# Altium project TS_24_TSAL_PCB.PrjPcb
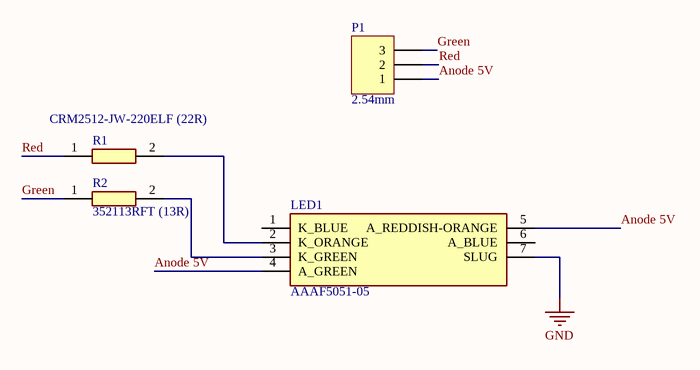
[diagram p0: TSAL_Schematic.SchDoc]
1 sheet, 4 parts. Net scope: global (net labels, ports and power ports of the same name join across sheets).
Board file: PCB1.PcbDoc

## Sheet TSAL_Schematic.SchDoc
size A4

### Parts
LED1  AAAF5051-05  [AAAF505105]
P1  2.54mm  [TH 2.54mm Header 1x3]
R1  CRM2512-JW-220ELF (22R)  [RESC6331X80N]
R2  352113RFT (13R)  [RESC6432X65N]

### Nets
GND: LED1.7(SLUG)
Anode 5V: LED1.4(A_GREEN) LED1.5(A_REDDISH-ORANGE) P1.1
Green: P1.3 R2.1
Red: P1.2 R1.1
NetLED1_2: LED1.2(K_ORANGE) R1.2
NetLED1_3: LED1.3(K_GREEN) R2.2

Not connected (* = marked no-connect by the designer): LED1 1(K_BLUE) 6(A_BLUE)

### Library data of the parts
LED1 = AAAF5051-05: LED; Manufacturer_Name: Kingbright; Datasheet Link: http://www.kingbrightusa.com/images/catalog/SPEC/AAAF5051-05.pdf; Height: 1.4mm; Manufacturer_Part_Number: AAAF5051-05; Mouser Part Number: 604-AAAF5051-05; Mouser Price/Stock: https://www.mouser.co.uk/ProductDetail/Kingbright/AAAF5051-05?qs=wUXugUrL1qwwviBwwIcUtw%3D%3D; Arrow Part Number: AAAF5051-05; Arrow Price/Stock: https://www.arrow.com/en/products/aaaf5051-05/kingbright?region=nac
P1 = TH 2.54mm Header 1x3: Positions: 3; Angle: 0; Flange: No; Contact: NA; Part Number: TH 2.54mm Header 1x3; Pitch: 2.54mm; Row Spacing: 2.54mm
R1 = CRM2512-JW-220ELF: Resistor; Manufacturer_Name: Bourns; Datasheet Link: http://www.bourns.com/data/global/pdfs/CRM0805_1206_2010.pdf; Height: 0.8mm; Manufacturer_Part_Number: CRM2512-JW-220ELF; Mouser Part Number: 652-CRM2512-JW220ELF; Mouser Price/Stock: https://www.mouser.co.uk/ProductDetail/Bourns/CRM2512-JW-220ELF/?qs=9fn1gpisni4fbNEQP%252BkdCw%3D%3D; Arrow Part Number: CRM2512-JW-220ELF; Arrow Price/Stock: https://www.arrow.com/en/products/crm2512-jw-220elf/bourns?region=nac
R2 = 352113RFT: Resistor; Manufacturer_Name: TE Connectivity; Datasheet Link: https://www.te.com/commerce/DocumentDelivery/DDEController?Action=srchrtrv&DocNm=9-1773463-5&DocType=Data%20Sheet&DocLang=English&PartCntxt=2176070-4&DocFormat=pdf; Height: 0.65mm; Manufacturer_Part_Number: 352113RFT; Mouser Part Number: 279-352113RFT; Mouser Price/Stock: https://www.mouser.co.uk/ProductDetail/TE-Connectivity-Holsworthy/352113RFT?qs=2kOmHSv6VfT3PsR8sAsIxg%3D%3D